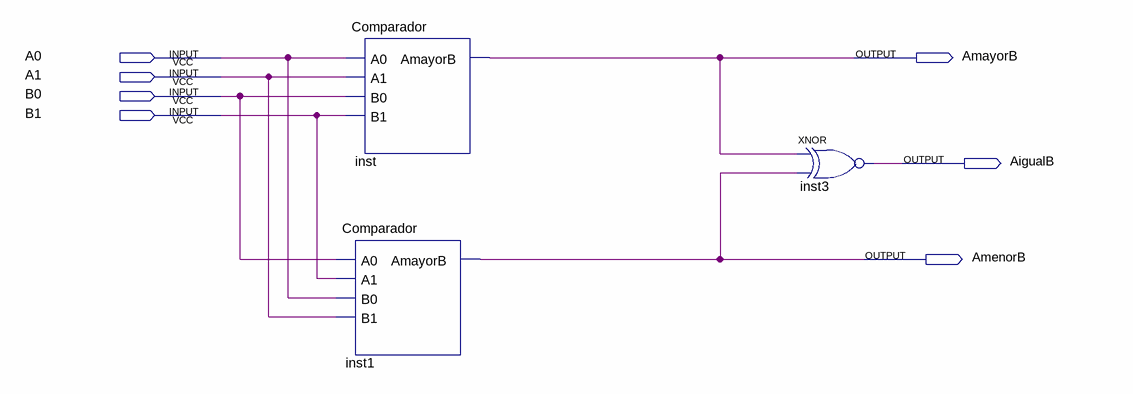
[diagram p0: schematic sheet]
// Quartus schematic Comparador2.bdf as structural Verilog: 3 symbols, 7 pins
module Comparador2 (
  input  A0,
  input  A1,
  input  B0,
  input  B1,
  output AmayorB,
  output AigualB,
  output AmenorB
);

  Comparador inst (.A0(A0), .A1(A1), .B0(B0), .B1(B1), .AmayorB(AmayorB));
  Comparador inst1 (.A0(B0), .A1(B1), .B0(A0), .B1(A1), .AmayorB(AmenorB));
  xnor inst3 (AigualB, AmayorB, AmenorB);
endmodule
